# EAGLE schematic Walletv3 (EAGLE 9.0.0)

## Sheet 1 of 3
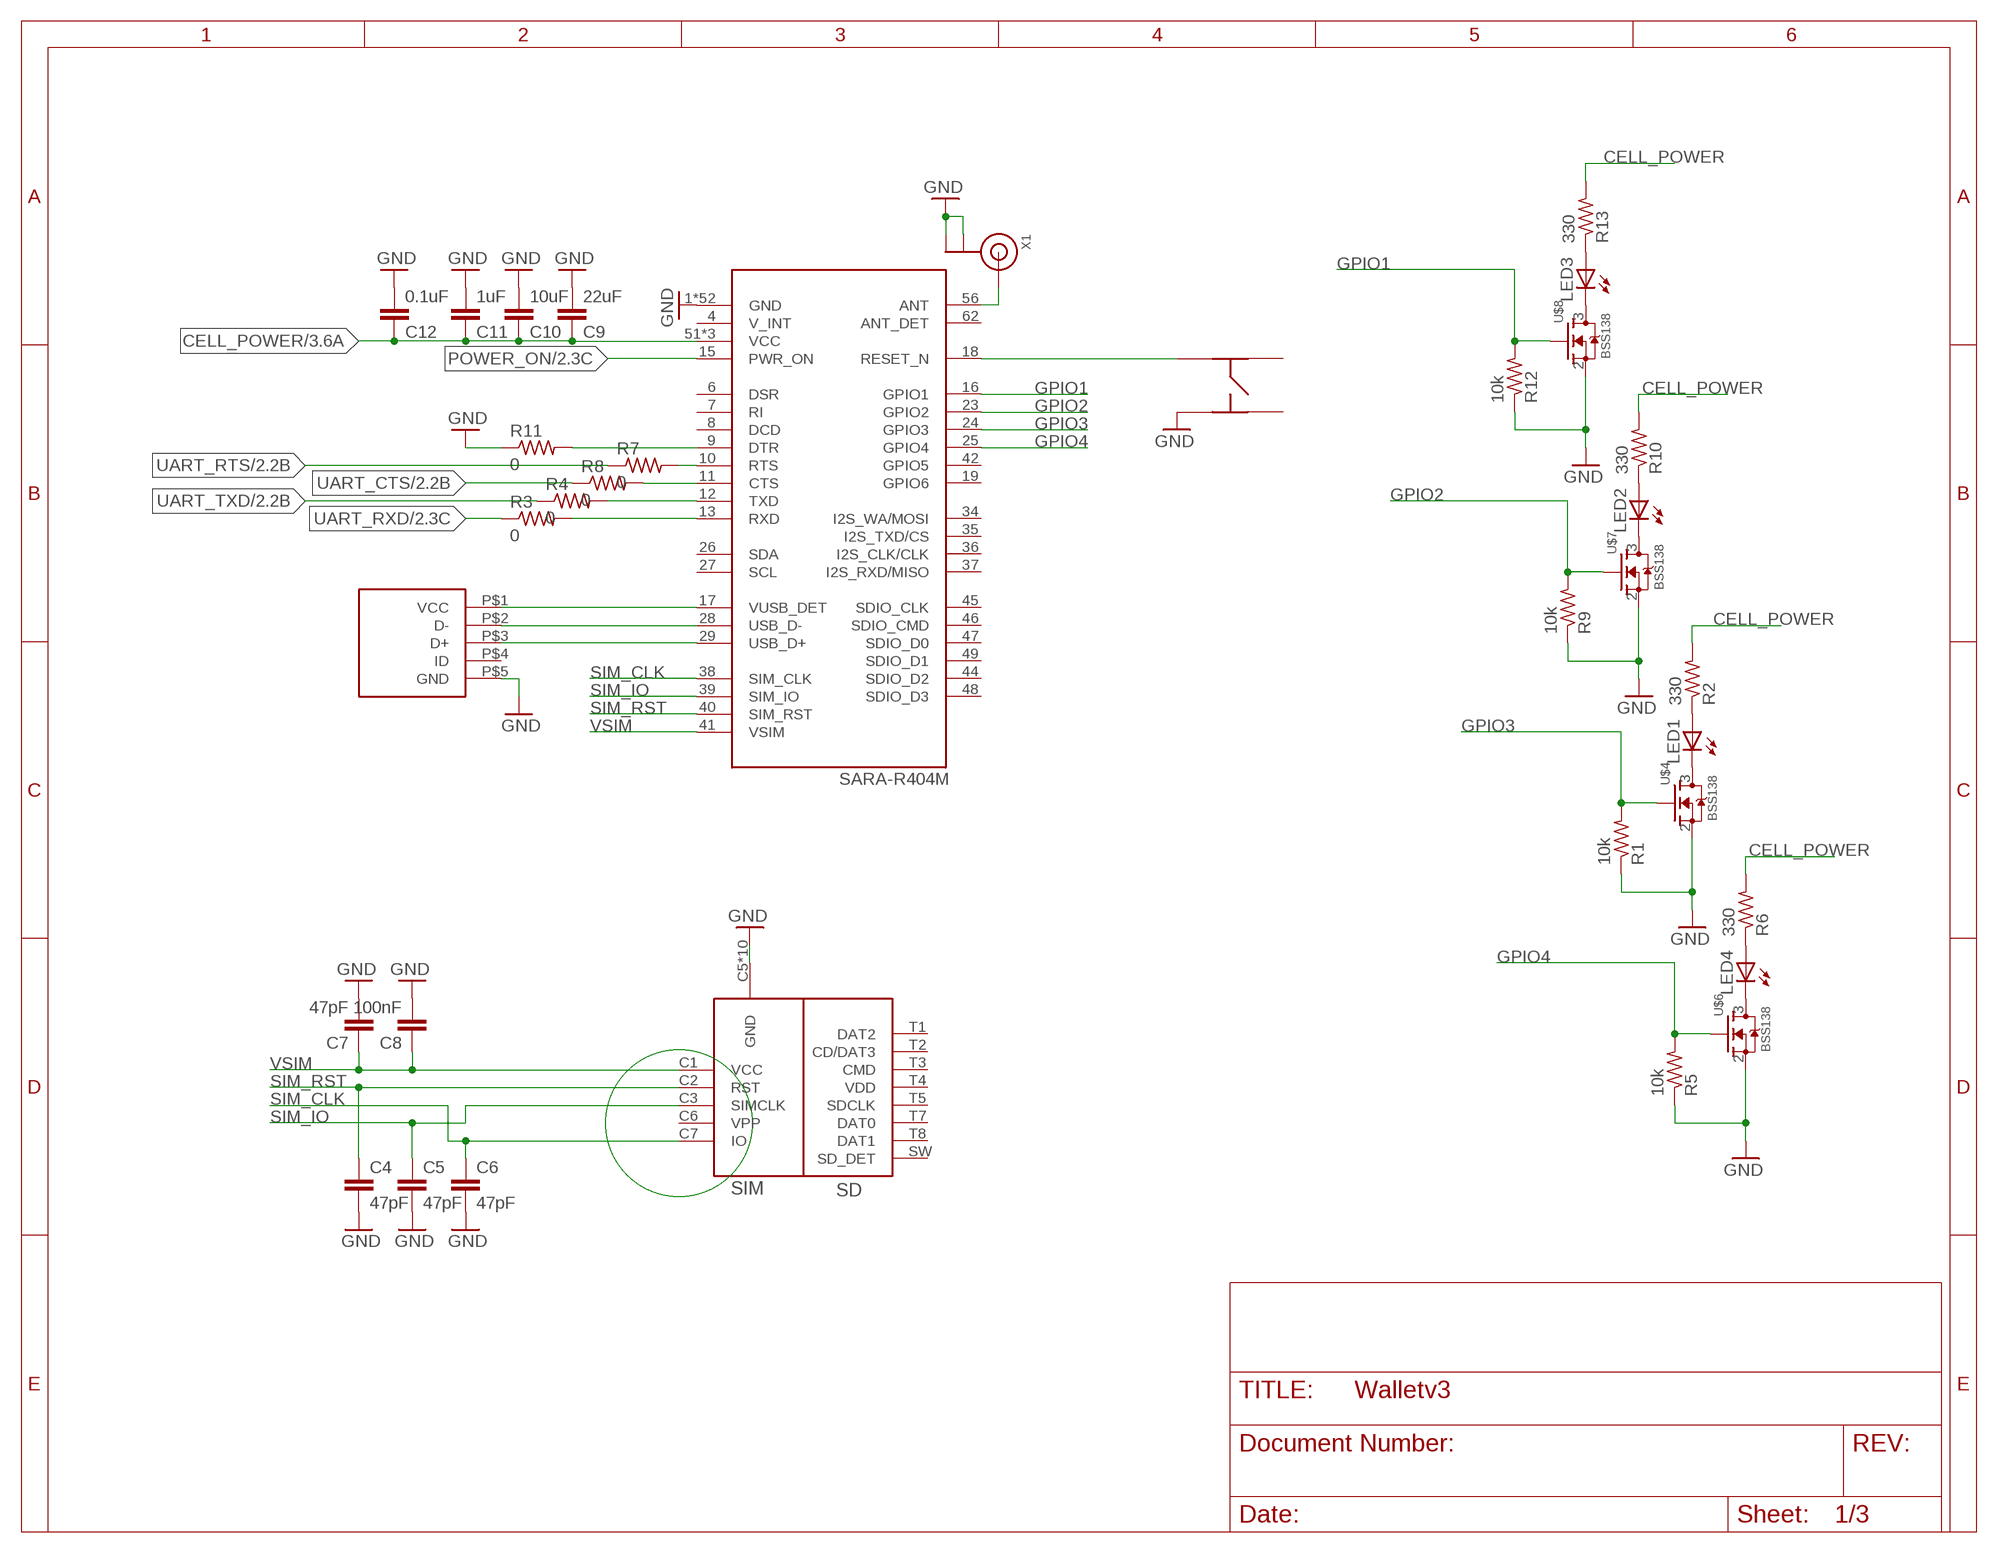
[diagram p0: schematic, sheet 1]

### Parts
C4  47pF  C-EUC0402  [C0402]
C5  47pF  C-EUC0402  [C0402]
C6  47pF  C-EUC0402  [C0402]
C7  47pF  C-EUC0402  [C0402]
C8  100nF  C-EUC0402  [C0402]
C9  22uF  C-EUC0805  [C0805]
C10  10uF  C-EUC0603  [C0603]
C11  1uF  C-EUC0402  [C0402]
C12  0.1uF  C-EUC0402  [C0402]
LED1  LEDCHIPLED_0603  [CHIPLED_0603]
LED2  LEDCHIPLED_0603  [CHIPLED_0603]
LED3  LEDCHIPLED_0603  [CHIPLED_0603]
LED4  LEDCHIPLED_0603  [CHIPLED_0603]
R1  10k  R-US_R0402  [R0402]
R2  330  R-US_R0402  [R0402]
R3  0  R-US_R0402  [R0402]
R4  0  R-US_R0402  [R0402]
R5  10k  R-US_R0402  [R0402]
R6  330  R-US_R0402  [R0402]
R7  0  R-US_R0402  [R0402]
R8  0  R-US_R0402  [R0402]
R9  10k  R-US_R0402  [R0402]
R10  330  R-US_R0402  [R0402]
R11  0  R-US_R0402  [R0402]
R12  10k  R-US_R0402  [R0402]
R13  330  R-US_R0402  [R0402]
U$2  SIM_SD_MOLEX  [SIM_SD_MOLEX]
U$3  SARA-R404M  [SARA-R404M]
U$4  BSS138  [SOT23-3]
U$5  MICRO_USB  [MOLEX_USB]
U$6  BSS138  [SOT23-3]
U$7  BSS138  [SOT23-3]
U$8  BSS138  [SOT23-3]
U$9  KMR731NG  [KMR731NG]
X1  ANTENNA_U.FL  [U.FL]

### Nets
CELL_POWER: C9.1 C10.1 C11.1 C12.1 R2.2 R6.2 R10.2 R13.2 U$3.51(VCC) U$3.52(VCC) U$3.53(VCC) ; also sheet 2,3
GND: C4.2 C5.2 C6.2 C7.2 C8.2 C9.2 C10.2 C11.2 C12.2 R1.1 R5.1 R9.1 R11.1 R12.1 U$2.C5(GND) U$2.G1(GND) U$2.G2(GND) U$2.G3(GND) U$2.G4(GND) U$2.G5(GND) U$2.G6(GND) U$2.G7(GND) U$2.G8(GND) U$2.T6(GND) U$3.1(GND) U$3.3(GND) U$3.5(GND) U$3.14(GND) U$3.20(GND) U$3.21(GND) U$3.22(GND) U$3.30(GND) U$3.32(GND) U$3.43(GND) U$3.50(GND) U$3.54(GND) U$3.55(GND) U$3.57(GND) U$3.58(GND) U$3.59(GND) U$3.60(GND) U$3.61(GND) U$3.63(GND) U$3.64(GND) U$3.65(GND) U$3.66(GND) U$3.67(GND) U$3.68(GND) U$3.69(GND) U$3.70(GND) U$3.71(GND) U$3.72(GND) U$3.73(GND) U$3.74(GND) U$3.75(GND) U$3.76(GND) U$3.77(GND) U$3.78(GND) U$3.79(GND) U$3.80(GND) U$3.81(GND) U$3.82(GND) U$3.83(GND) U$3.84(GND) U$3.85(GND) U$3.86(GND) U$3.87(GND) U$3.88(GND) U$3.89(GND) U$3.90(GND) U$3.91(GND) U$3.92(GND) U$3.93(GND) U$3.94(GND) U$3.95(GND) U$3.96(GND) U$4.2(S) U$5.P$5(GND) U$6.2(S) U$7.2(S) U$8.2(S) U$9.P$4 X1.1(GND) X1.2(GND) ; also sheet 2,3
GPIO1: R12.2 U$3.16(GPIO1) U$8.1(G)
GPIO2: R9.2 U$3.23(GPIO2) U$7.1(G)
GPIO3: R1.2 U$3.24(GPIO3) U$4.1(G)
GPIO4: R5.2 U$3.25(GPIO4) U$6.1(G)
N$1: U$3.17(VUSB_DET) U$5.P$1(VCC)
N$2: U$3.28(USB_D-) U$5.P$2(D-)
N$3: U$3.29(USB_D+) U$5.P$3(D+)
N$4: LED1.C U$4.3(D)
N$5: U$3.18(RESET_N) U$9.P$1
N$6: LED1.A R2.1
N$7: R4.2 U$3.12(TXD)
N$8: R3.2 U$3.13(RXD)
N$9: LED2.C U$7.3(D)
N$11: LED2.A R10.1
N$12: U$3.56(ANT) X1.3(SIGNAL)
N$13: R11.2 U$3.9(DTR)
N$14: LED4.C U$6.3(D)
N$15: LED4.A R6.1
N$17: LED3.C U$8.3(D)
N$18: R8.2 U$3.11(CTS)
N$19: R7.2 U$3.10(RTS)
N$21: LED3.A R13.1
POWER_ON: U$3.15(PWR_ON) ; also sheet 2
SIM_CLK: C6.1 U$2.C7(IO) U$3.38(SIM_CLK)
SIM_IO: C5.1 U$2.C3(SIMCLK) U$3.39(SIM_IO)
SIM_RST: C4.1 U$2.C2(RST) U$3.40(SIM_RST)
UART_CTS: R8.1 ; also sheet 2
UART_RTS: R7.1 ; also sheet 2
UART_RXD: R3.1 ; also sheet 2
UART_TXD: R4.1 ; also sheet 2
VSIM: C7.1 C8.1 U$2.C1(VCC) U$3.41(VSIM)
Unconnected: U$2.C6(VPP) U$2.SW(SD_DET) U$2.T1(DAT2) U$2.T2(CD/DAT3) U$2.T3(CMD) U$2.T4(VDD) U$2.T5(SDCLK) U$2.T7(DAT0) U$2.T8(DAT1) U$3.4(V_INT) U$3.6(DSR) U$3.7(RI) U$3.8(DCD) U$3.19(GPIO6) U$3.26(SDA) U$3.27(SCL) U$3.34(I2S_WA/MOSI) U$3.35(I2S_TXD/CS) U$3.36(I2S_CLK/CLK) U$3.37(I2S_RXD/MISO) U$3.42(GPIO5) U$3.44(SDIO_D2) U$3.45(SDIO_CLK) U$3.46(SDIO_CMD) U$3.47(SDIO_D0) U$3.48(SDIO_D3) U$3.49(SDIO_D1) U$3.62(ANT_DET) U$5.P$4(ID) U$9.P$2 U$9.P$3

## Sheet 2 of 3
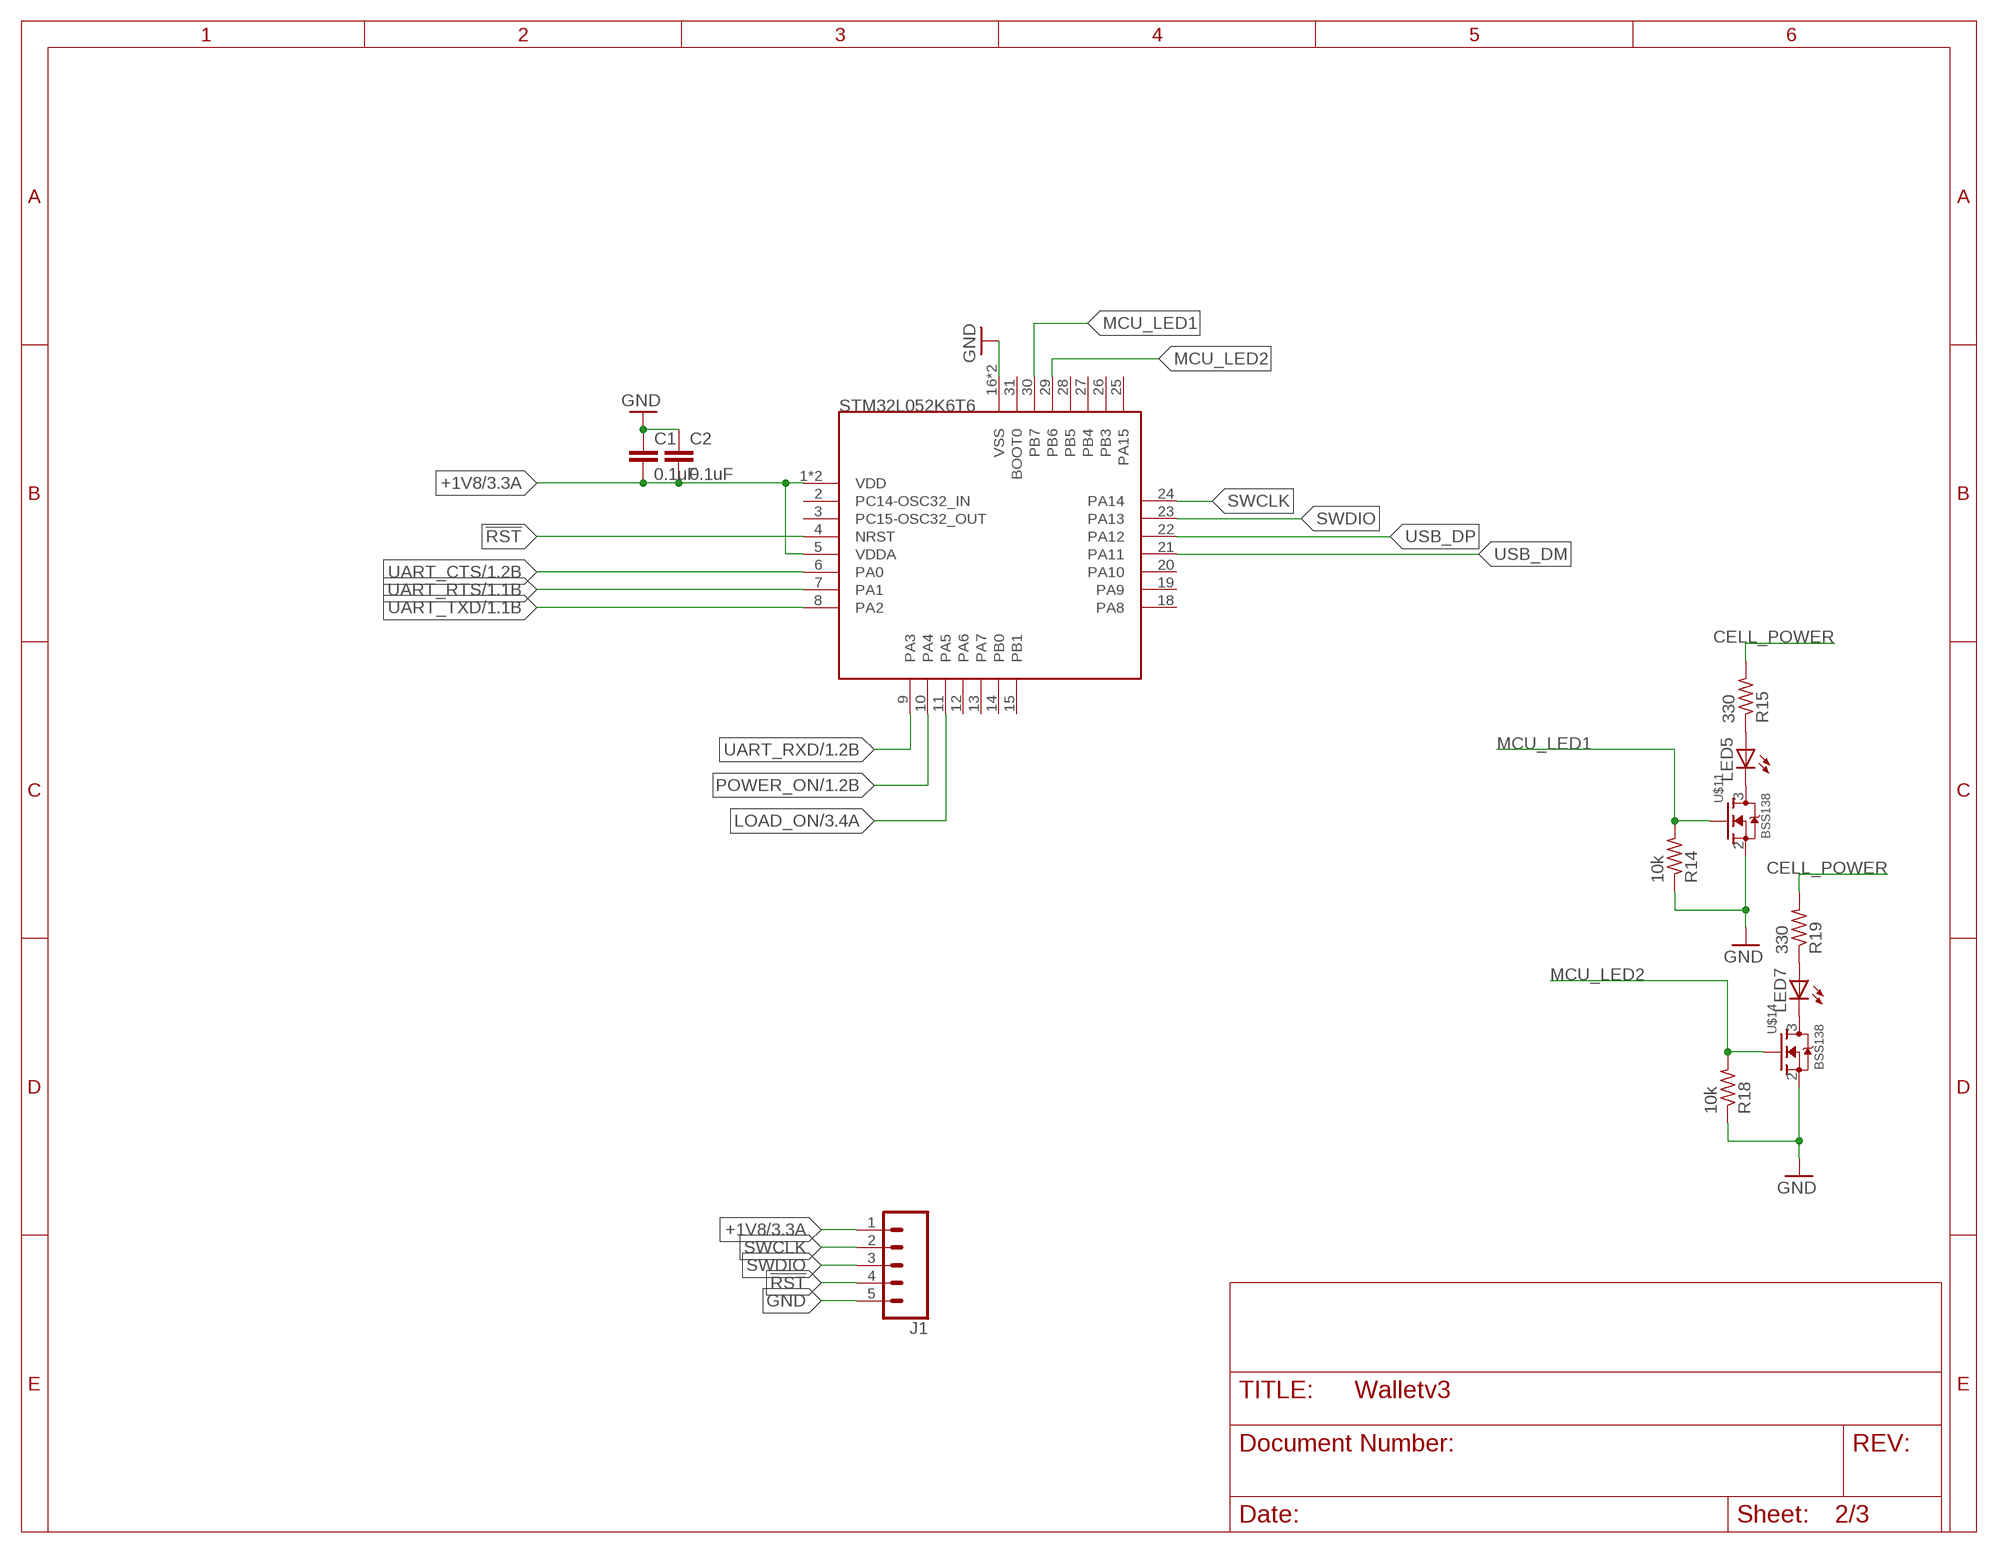
[diagram p1: schematic, sheet 2]

### Parts
C1  0.1uF  C-EUC0402  [C0402]
C2  0.1uF  C-EUC0402  [C0402]
J1  CONN_05  [1X05]
LED5  LEDCHIPLED_0603  [CHIPLED_0603]
LED7  LEDCHIPLED_0603  [CHIPLED_0603]
R14  10k  R-US_R0402  [R0402]
R15  330  R-US_R0402  [R0402]
R18  10k  R-US_R0402  [R0402]
R19  330  R-US_R0402  [R0402]
U$1  STM32L052K6T6LQFP32-7X7  [QFP80P900X900X160-32]
U$11  BSS138  [SOT23-3]
U$14  BSS138  [SOT23-3]

### Nets
!RST: J1.4 U$1.4(NRST)
+1V8: C1.2 C2.2 J1.1 U$1.1(VDD) U$1.5(VDDA) U$1.17(VDD) ; also sheet 3
CELL_POWER: R15.2 R19.2 ; also sheet 1,3
GND: C1.1 C2.1 J1.5 R14.1 R18.1 U$1.16(VSS) U$1.32(VSS) U$11.2(S) U$14.2(S) ; also sheet 1,3
LOAD_ON: U$1.11(PA5) ; also sheet 3
MCU_LED1: R14.2 U$1.30(PB7) U$11.1(G)
MCU_LED2: R18.2 U$1.29(PB6) U$14.1(G)
N$10: LED5.C U$11.3(D)
N$16: LED5.A R15.1
N$23: LED7.C U$14.3(D)
N$26: LED7.A R19.1
POWER_ON: U$1.10(PA4) ; also sheet 1
SWCLK: J1.2 U$1.24(PA14)
SWDIO: J1.3 U$1.23(PA13)
UART_CTS: U$1.6(PA0) ; also sheet 1
UART_RTS: U$1.7(PA1) ; also sheet 1
UART_RXD: U$1.9(PA3) ; also sheet 1
UART_TXD: U$1.8(PA2) ; also sheet 1
USB_DM: U$1.21(PA11)
USB_DP: U$1.22(PA12)
Unconnected: U$1.2(PC14-OSC32_IN) U$1.3(PC15-OSC32_OUT) U$1.12(PA6) U$1.13(PA7) U$1.14(PB0) U$1.15(PB1) U$1.18(PA8) U$1.19(PA9) U$1.20(PA10) U$1.25(PA15) U$1.26(PB3) U$1.27(PB4) U$1.28(PB5) U$1.31(BOOT0)

## Sheet 3 of 3
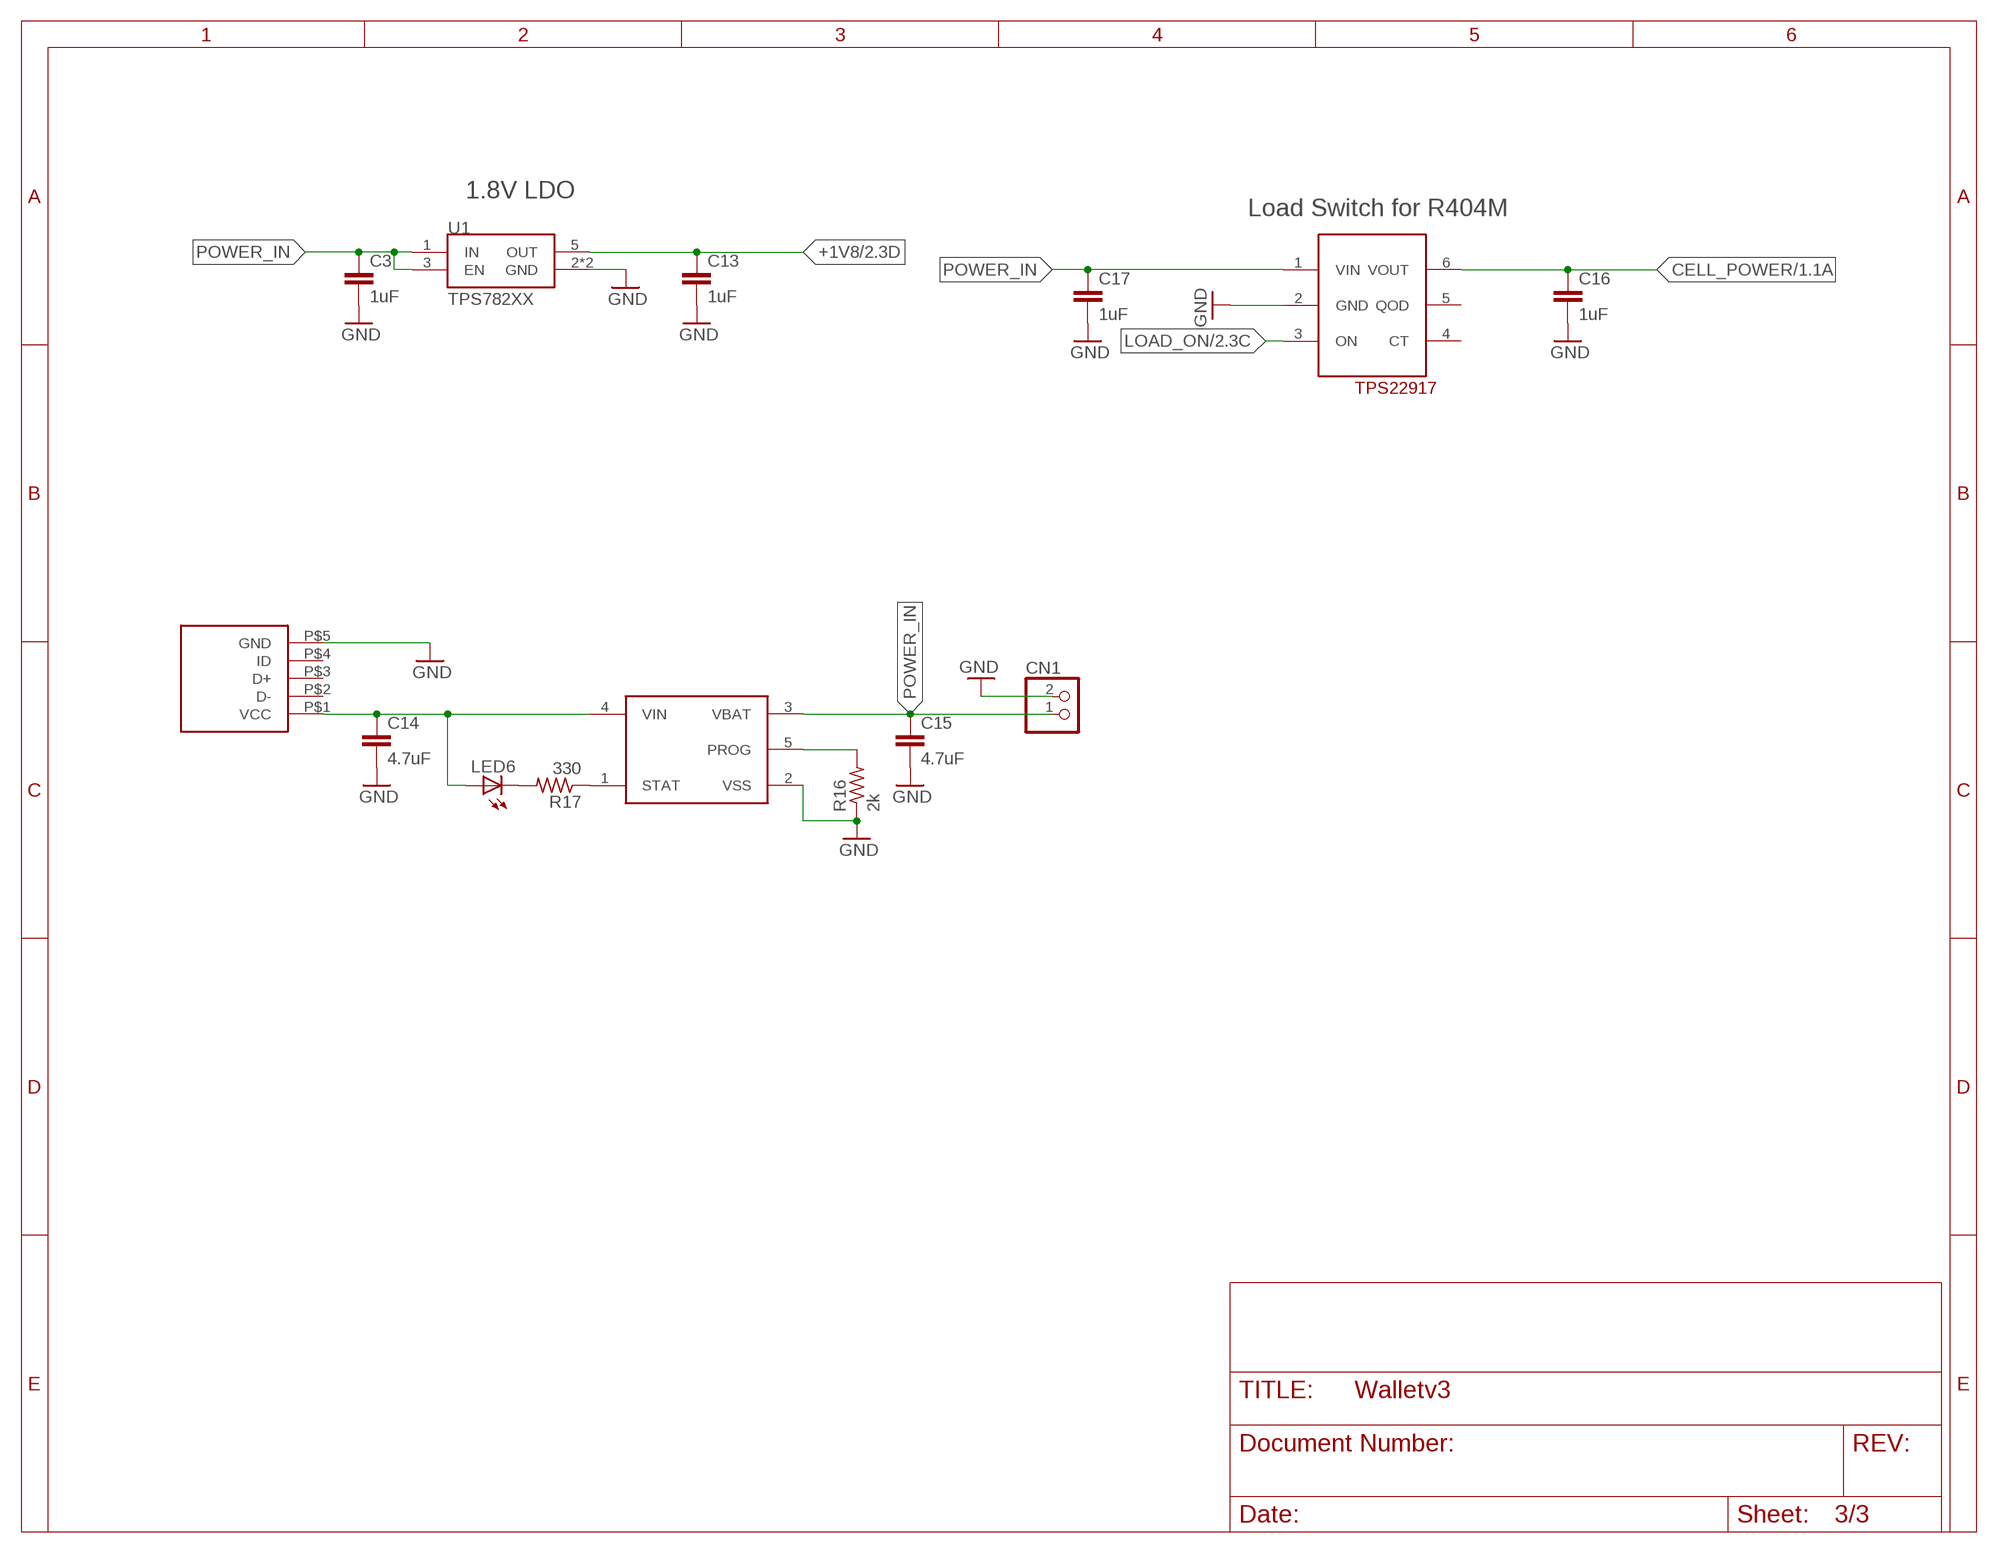
[diagram p2: schematic, sheet 3]

### Parts
C3  1uF  C-EUC0402  [C0402]
C13  1uF  C-EUC0402  [C0402]
C14  4.7uF  C-EUC0603  [C0603]
C15  4.7uF  C-EUC0603  [C0603]
C16  1uF  C-EUC0402  [C0402]
C17  1uF  C-EUC0402  [C0402]
CN1  JST_2PIN-SMT-RA  [JST-PH-2-SMT-RA]
LED6  LEDCHIP-LED0603  [CHIP-LED0603]
R16  2k  R-US_R0402  [R0402]
R17  330  R-US_R0402  [R0402]
U1  TPS782XX  [SOT23-5L]
U$10  TPS22917  [SOT23-6]
U$12  MICRO_USB  [MOLEX_USB]
U$13  MCP73831  [SOT23-5L]

### Nets
+1V8: C13.1 U1.5(OUT) ; also sheet 2
CELL_POWER: C16.1 U$10.6(VOUT) ; also sheet 1,2
GND: C3.2 C13.2 C14.2 C15.2 C16.2 C17.2 CN1.2 R16.1 U1.2(GND) U1.4(GND) U$10.2(GND) U$12.P$5(GND) U$13.2(VSS) ; also sheet 1,2
LOAD_ON: U$10.3(ON) ; also sheet 2
N$20: C14.1 LED6.A U$12.P$1(VCC) U$13.4(VIN)
N$22: R16.2 U$13.5(PROG)
N$24: R17.1 U$13.1(STAT)
N$25: LED6.C R17.2
POWER_IN: C3.1 C15.1 C17.1 CN1.1 U1.1(IN) U1.3(EN) U$10.1(VIN) U$13.3(VBAT)
Unconnected: U$10.4(CT) U$10.5(QOD) U$12.P$2(D-) U$12.P$3(D+) U$12.P$4(ID)

### Notes on the sheet
- 1.8V LDO
- Load Switch for R404M

## Library data of the parts
C1-C17 = rcl:C-EU: CAPACITOR, European symbol; SPICEPREFIX: C
CN1 = adafruit:JST_2PIN: JST 2-Pin Connectors of various flavors SMT-RA (S2B-PH-SM4) 4UConnector #17311 SMT (B2B-PH-SM4) THM-RA (S2B-PH) THM (B2B-PH)
J1 = SparkFun-Connectors:CONN_05: Multi connection point. Often used as Generic Header-pin footprint for 0.1 inch spaced/style header connections On any of the 0.1 inch spaced packages, you can populate with these: Break Away Headers - Straight <https://www.sparkfun.com/products/116> (PRT-00116) Break Away Male Headers - Right Angle <https://www.sparkfun.com/products/553> (PRT-00553) Female Headers <https://www.sparkfun.com/products/115> (PRT-00115) Break Away Headers - Machine Pin <https://www.sparkfun.com/products/117> (PRT-00117) Break Away Female Headers - Swiss Machine Pin <https://www.sparkfun.com/products/743> (PRT-00743) For SCREWTERMINALS and SPRING TERMINALS visit here: Screw Terimnals on SparkFun.com <https://www.sparkfun.com/search/results?term=Screw+Terminals> (5mm/3.5mm/2.54mm spacing) This device is also useful as a general connection point to wire up your design to another part of your project. Our various solder wires solder well into these plated through hole pads. Hook-Up Wire - Assortment (Stranded, 22 AWG) <https://www.sparkfun.com/products/11375> (PRT-11375) Hook-Up Wire - Assortment (Solid Core, 22 AWG) <https://www.sparkfun.com/products/11367> (PRT-11367) View the entire wire category on our website here <https://www.sparkfun.com/categories/141> Special notes: Molex polarized connector foot print use with SKU : PRT-08231 with associated crimp pins and housings. 1MM SMD Version SKU: PRT-10208
LED1-LED7 = adafruit:LED: LED OSRAM: - CHIPLED LG R971, LG N971, LY N971, LG Q971, LY Q971, LO R971, LY R971 LH N974, LH R974 LS Q976, LO Q976, LY Q976 LO Q996 - Hyper CHIPLED LW Q18S LB Q993, LB Q99A, LB R99A - SideLED LS A670, LO A670, LY A670, LG A670, LP A670 LB A673, LV A673, LT A673, LW A673 LH A674 LY A675 LS A676, LA A676, LO A676, LY A676, LW A676 LS A679, LY A679, LG A679 - Hyper Micro SIDELED® LS Y876, LA Y876, LO Y876, LY Y876 LT Y87S - SmartLED LW L88C, LW L88S LB L89C, LB L89S, LG L890 LS L89K, LO L89K, LY L89K LS L896, LA L896, LO L896, LY L896 - TOPLED LS T670, LO T670, LY T670, LG T670, LP T670 LSG T670, LSP T670, LSY T670, LOP T670, LYG T670 LG T671, LOG T671, LSG T671 LB T673, LV T673, LT T673, LW T673 LH T674 LS T676, LA T676, LO T676, LY T676, LB T676, LH T676, LSB T676, LW T676 LB T67C, LV T67C, LT T67C, LS T67K, LO T67K, LY T67K, LW E67C LS E67B, LA E67B, LO E67B, LY E67B, LB E67C, LV E67C, LT E67C LW T67C LS T679, LY T679, LG T679 LS T770, LO T770, LY T770, LG T770, LP T770 LB T773, LV T773, LT T773, LW T773 LH T774 LS E675, LA E675, LY E675, LS T675 LS T776, LA T776, LO T776, LY T776, LB T776 LHGB T686 LT T68C, LB T68C - Hyper Mini TOPLED® LB M676 - Mini TOPLED Santana® LG M470 LS M47K, LO M47K, LY M47K Source: http://www.osram.convergy.de/
R1-R19 = rcl:R-US_: RESISTOR, American symbol; SPICEPREFIX: R
U1 = James_Updated:TPS782XX: TPS782 500-nA IQ,150-mA, Ultra-Low Quiescent Current Low-Dropout Linear Regulator
U$1 = Charles:STM32L052K6T6: ARM® Cortex®-M0+ STM32L0 Microcontroller IC 32-Bit 32MHz 32KB (32K x 8) FLASH 32-LQFP (7x7)
U$2 = Charles:SIM_SD_MOLEX
U$3 = Charles:SARA-R404M
U$4 U$6-U$8 U$11 U$14 = Charles:BSS138: MOSFET N-CH 50V 220MA
U$5 U$12 = Charles:MICRO_USB: Molex Micro USB AB RA SMD Bottom Mount
U$9 = Charles:KMR731NG: Tactile Switch SPST-NO Top Actuated Surface Mount
U$10 = Charles:TPS22917: 1 V–5.5-V, 2-A, 80-mΩ Ultra-Low Leakage Load Switch
U$13 = James_Updated:MCP73831
X1 = adafruit:ANTENNA_U.FL: U.FL Antenna Connector